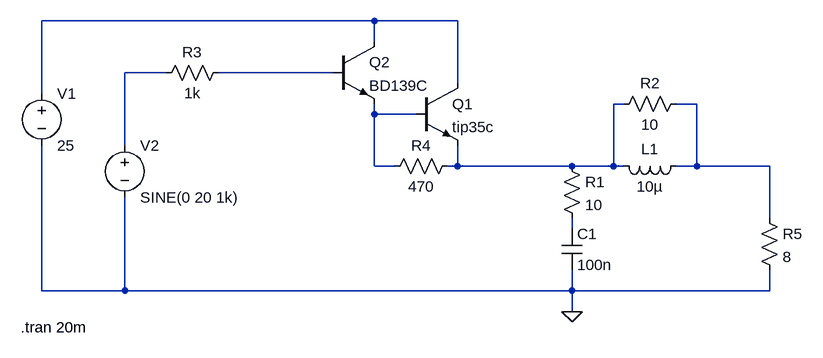
[diagram p0: schematic output_stage.asc]
output_stage.asc, the LTspice schematic file:
Version 4
SHEET 1 880 680
WIRE 144 -176 -368 -176
WIRE 272 -176 144 -176
WIRE 144 -144 144 -176
WIRE -176 -96 -240 -96
WIRE 80 -96 -96 -96
WIRE 272 -80 272 -176
WIRE -368 -64 -368 -176
WIRE 528 -48 512 -48
WIRE 640 -48 608 -48
WIRE 144 -32 144 -48
WIRE 208 -32 144 -32
WIRE -240 16 -240 -96
WIRE 144 48 144 -32
WIRE 176 48 144 48
WIRE 272 48 272 16
WIRE 272 48 256 48
WIRE 448 48 272 48
WIRE 512 48 512 -48
WIRE 512 48 448 48
WIRE 528 48 512 48
WIRE 640 48 640 -48
WIRE 640 48 608 48
WIRE 752 48 640 48
WIRE 752 128 752 48
WIRE 448 144 448 128
WIRE -368 240 -368 16
WIRE -240 240 -240 96
WIRE -240 240 -368 240
WIRE 448 240 448 208
WIRE 448 240 -240 240
WIRE 752 240 752 208
WIRE 752 240 448 240
WIRE 448 272 448 240
FLAG 448 272 0
SYMBOL npn 208 -80 R0
SYMATTR InstName Q1
SYMATTR Value tip35c
SYMBOL cap 432 144 R0
SYMATTR InstName C1
SYMATTR Value 100n
SYMBOL ind 624 32 R90
WINDOW 0 5 56 VBottom 2
WINDOW 3 32 56 VTop 2
SYMATTR InstName L1
SYMATTR Value 10µ
SYMBOL res 432 32 R0
SYMATTR InstName R1
SYMATTR Value 10
SYMBOL res 624 -64 R90
WINDOW 0 0 56 VBottom 2
WINDOW 3 32 56 VTop 2
SYMATTR InstName R2
SYMATTR Value 10
SYMBOL res -80 -112 R90
WINDOW 0 0 56 VBottom 2
WINDOW 3 32 56 VTop 2
SYMATTR InstName R3
SYMATTR Value 1k
SYMBOL voltage -368 -80 R0
WINDOW 123 0 0 Left 0
WINDOW 39 0 0 Left 0
SYMATTR InstName V1
SYMATTR Value 25
SYMBOL voltage -240 0 R0
WINDOW 123 0 0 Left 0
WINDOW 39 0 0 Left 0
SYMATTR InstName V2
SYMATTR Value SINE(0 20 1k)
SYMBOL npn 80 -144 R0
SYMATTR InstName Q2
SYMATTR Value BD139C
SYMBOL res 272 32 R90
WINDOW 0 0 56 VBottom 2
WINDOW 3 32 56 VTop 2
SYMATTR InstName R4
SYMATTR Value 470
SYMBOL res 736 112 R0
SYMATTR InstName R5
SYMATTR Value 8
TEXT -400 296 Left 2 !.tran 20m

The netlist it stands for:
* output_stage.asc
Q1 N001 N006 N004 0 tip35c
C1 N007 0 100n
L1 N005 N004 10µ
R1 N004 N007 10
R2 N005 N004 10
R3 N003 N002 1k
V1 N001 0 25
V2 N002 0 SINE(0 20 1k)
Q2 N001 N003 N006 0 BD139C
R4 N004 N006 470
R5 N005 0 8
.model NPN NPN
.model PNP PNP
.lib standard.bjt
.tran 20m
.backanno
.end